# EAGLE board dw08a4lyr (EAGLE 6.6.0), part 1 of 3
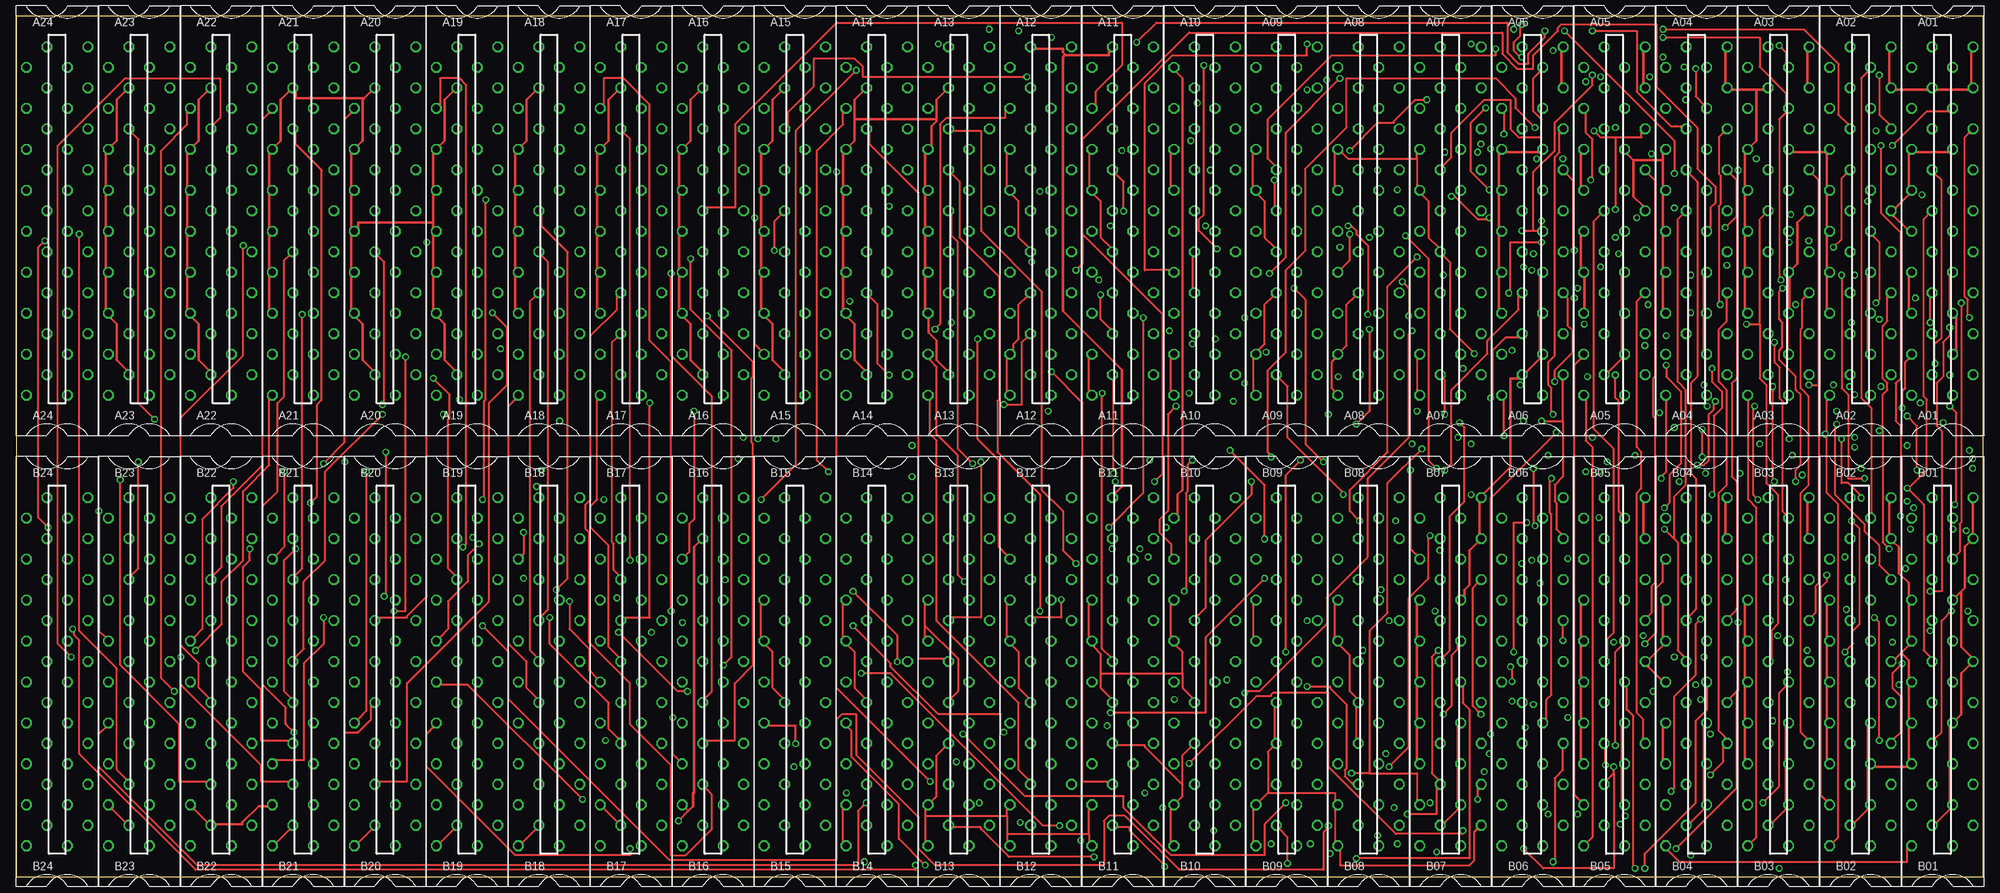
[diagram p6: board, top side]
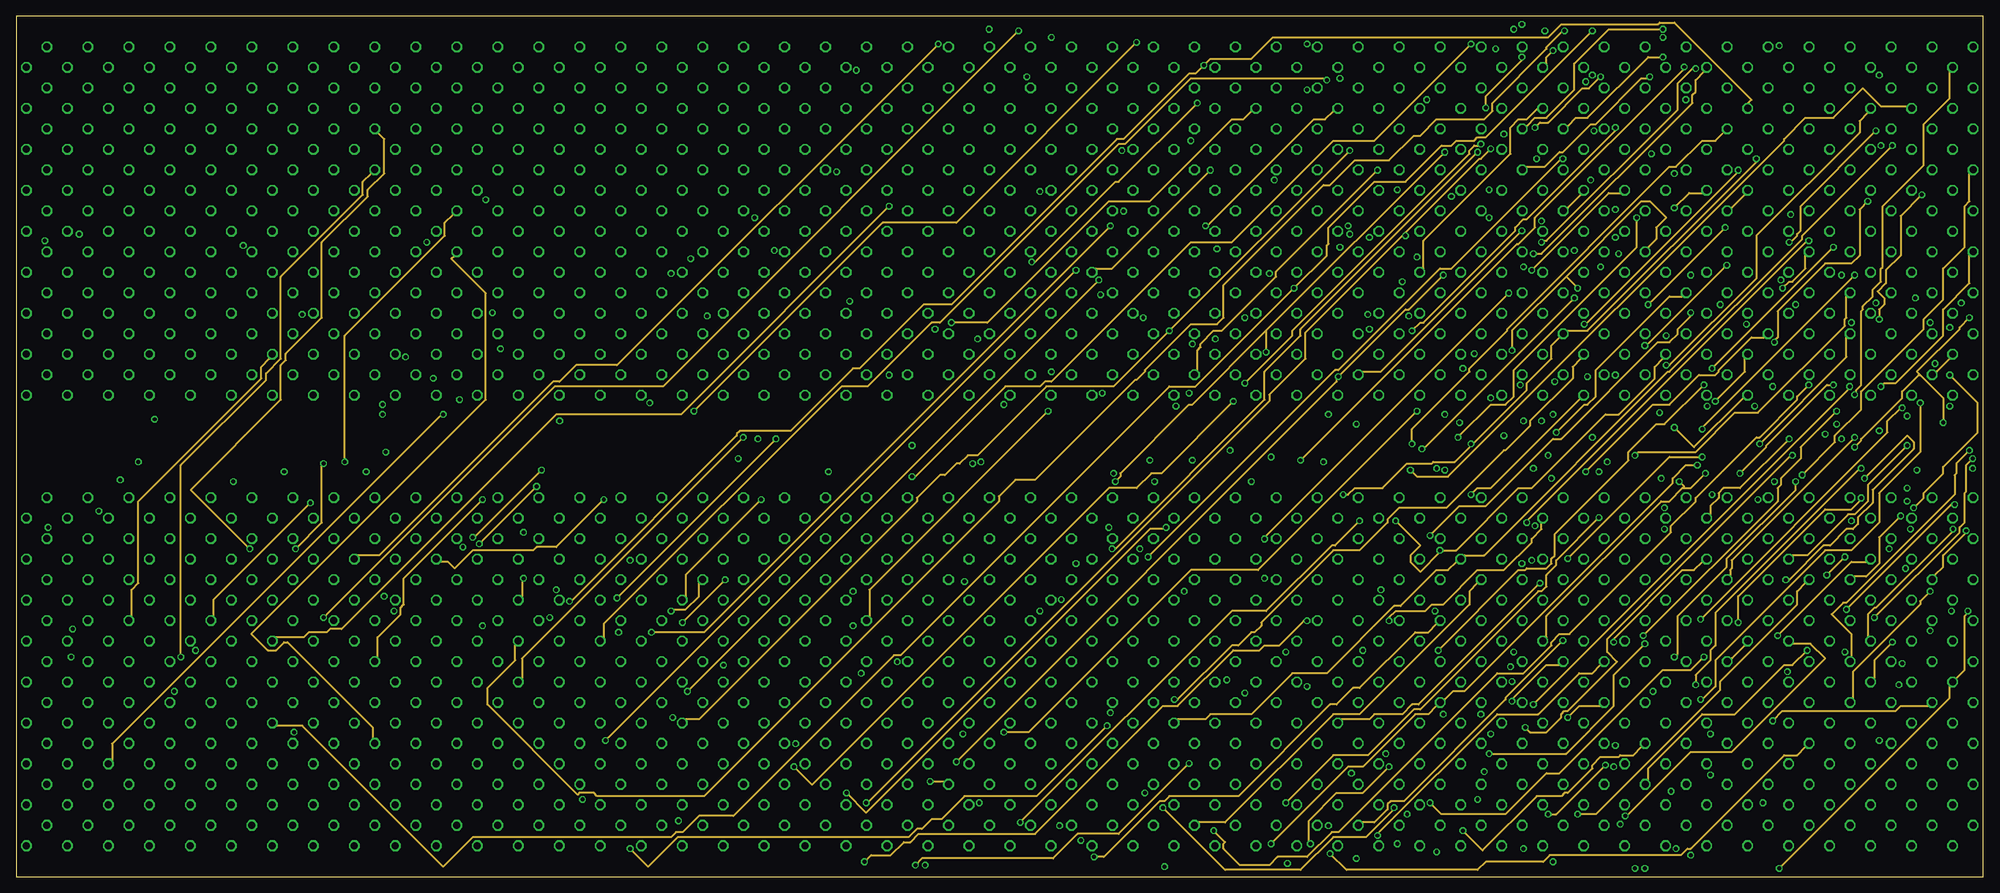
[diagram p7: board, inner layer 2]
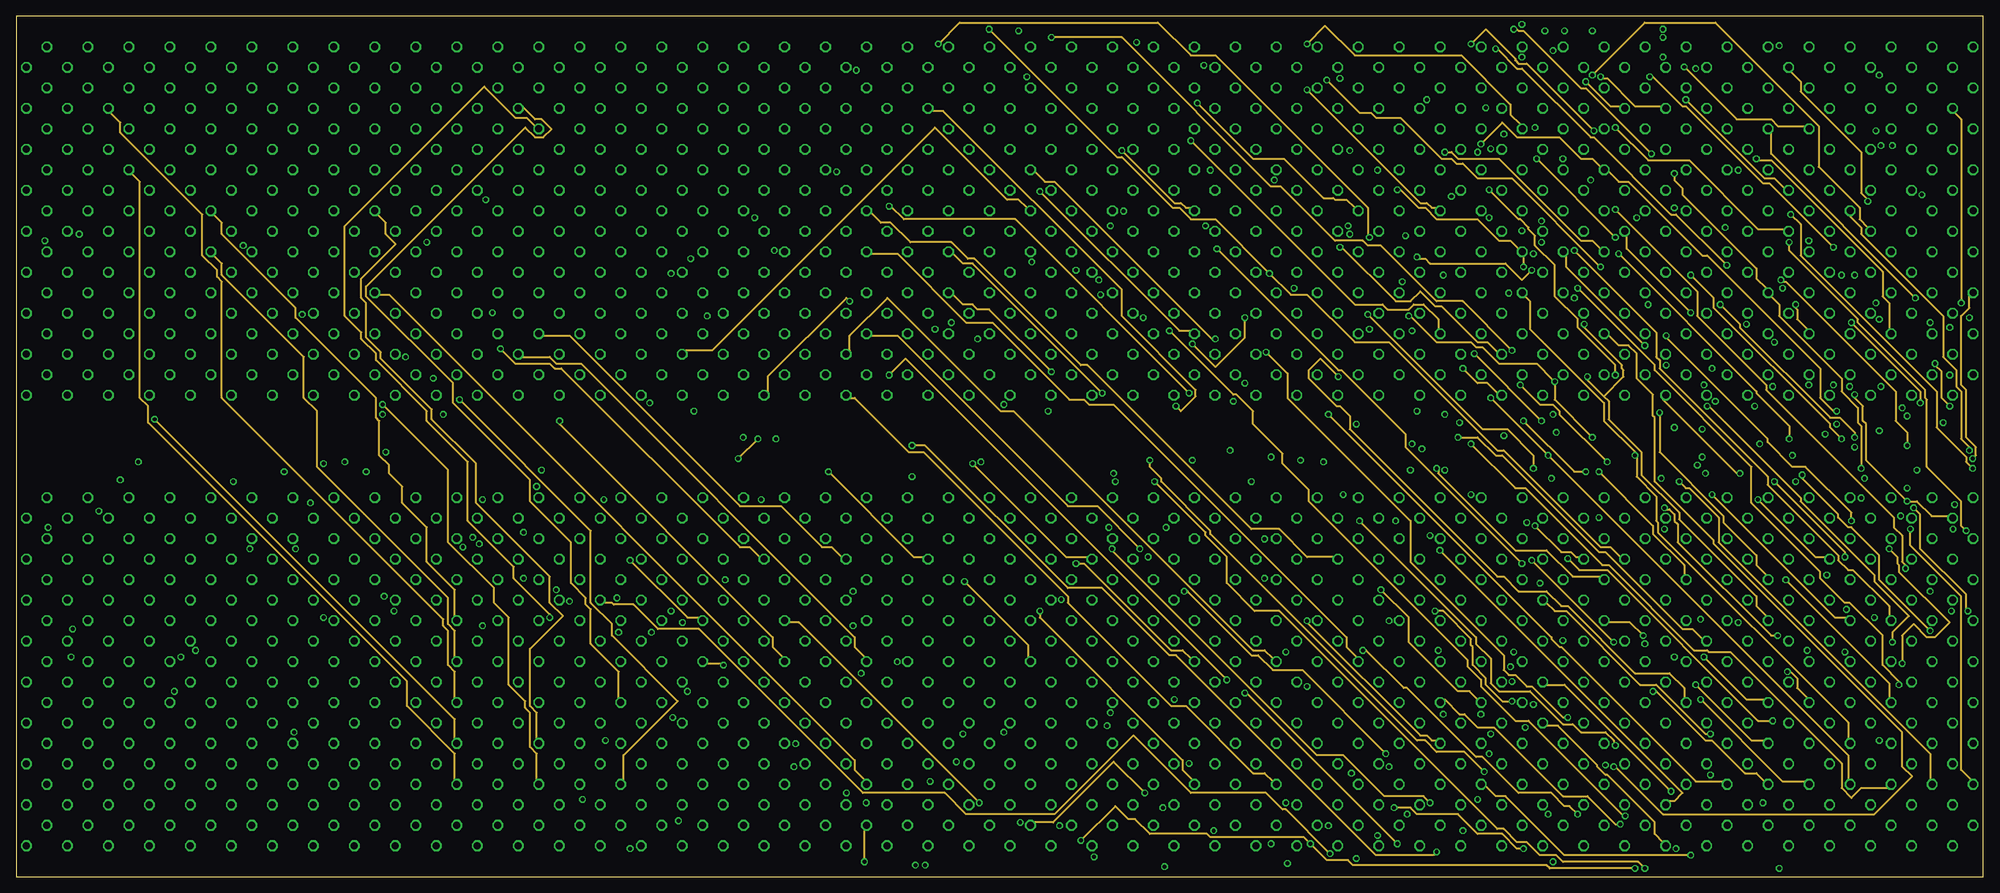
[diagram p8: board, inner layer 15]
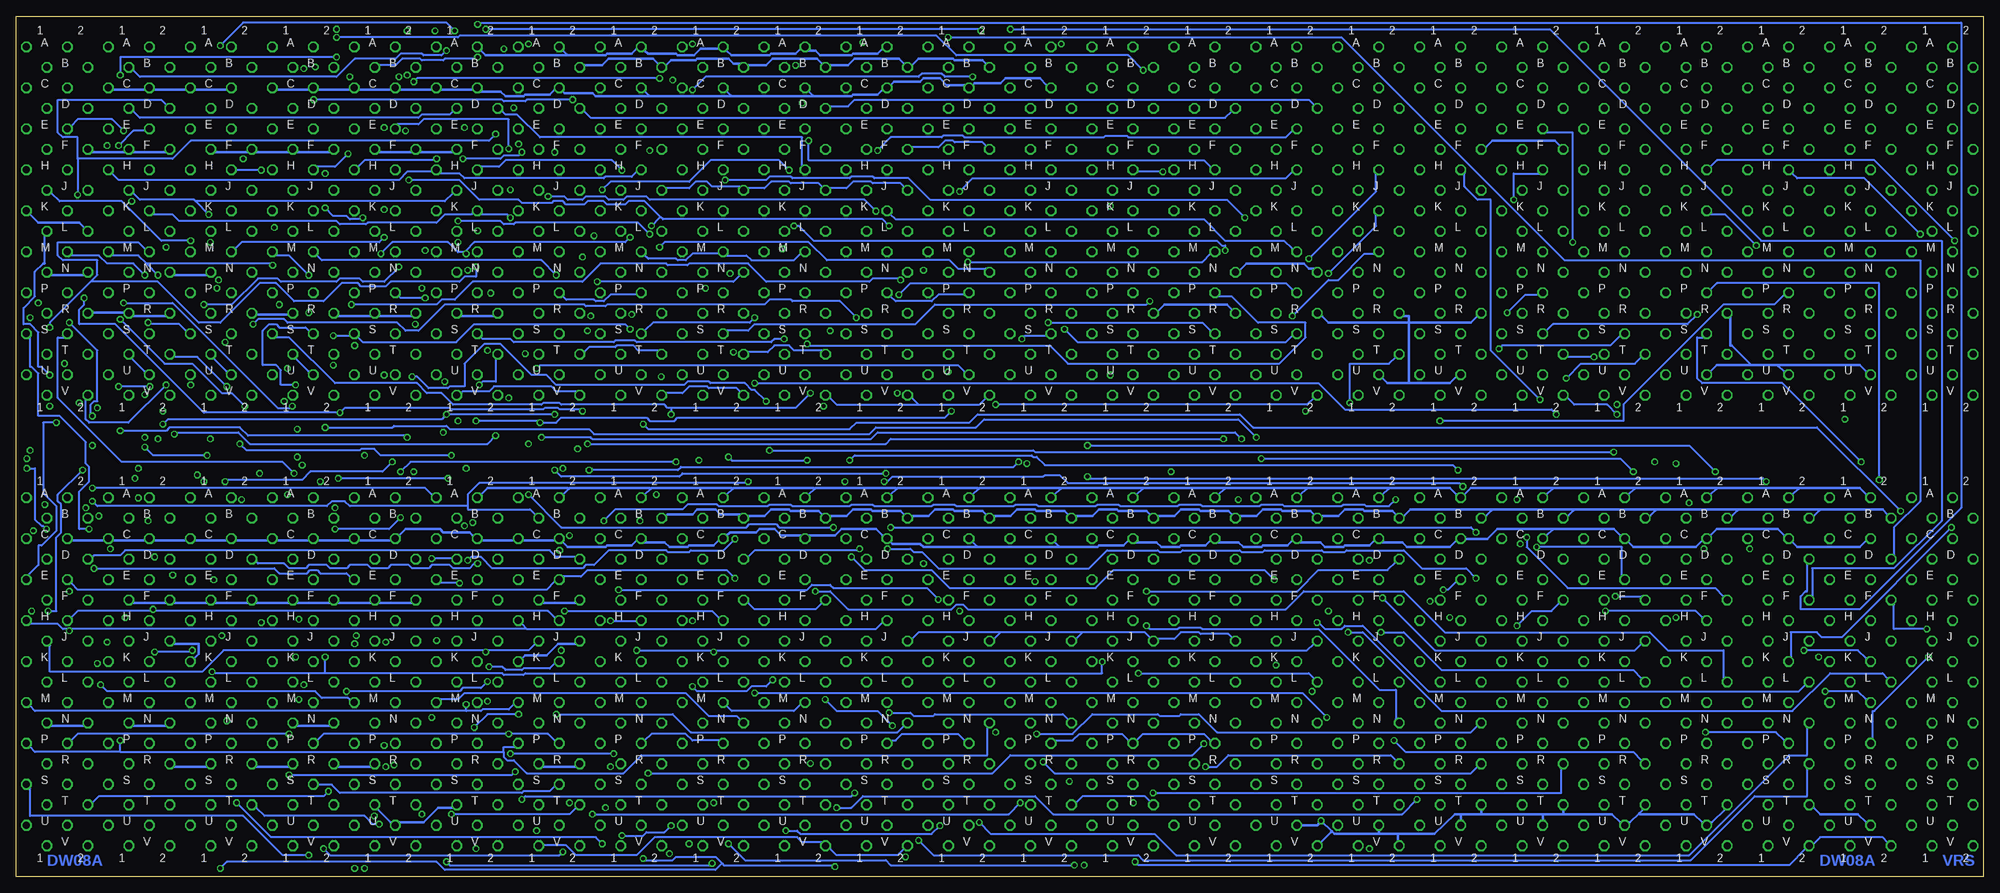
[diagram p9: board, bottom side, seen from below]

Size 304.8 x 133.35 mm. Coordinates in mm from the lower left corner, seen from the top.
Outline: 0,0 304.8,0 304.8,133.35 0,133.35 0,0
Copper layers (1*2*15*16): Top 0.035mm / dielectric 1.5mm / 2 0.035mm / dielectric 0.15mm / 15 0.035mm / dielectric 0.2mm / Bottom 0.035mm
Design rules "10mils": minimum track width 12mil, minimum drill 24mil, track to track 10mil, track to pad 10mil, pad to pad 10mil, via to via 10mil, smd to smd 10mil, copper to edge 25mil, drill to drill 10mil, minimum pad ring 10mil, minimum via ring 8mil, stop-mask expansion 0mil, vias tented up to drill 0mil, thermal gap 10mil
Net classes: 1 supply: width 0.381 mm

## Footprints (pad centres in the part's own frame; a part is rotated, then mirrored left to right if it is on the bottom)
H807 = drill 1.092 octagon: A1 4.763,28.575; A2 -1.587,28.575; B1 1.587,25.4; B2 -4.763,25.4; C1 4.763,22.225; C2 -1.587,22.225; D1 1.587,19.05; D2 -4.763,19.05; E1 4.763,15.875; E2 -1.587,15.875; F1 1.587,12.7; F2 -4.763,12.7; H1 4.763,9.525; H2 -1.587,9.525; J1 1.587,6.35; J2 -4.763,6.35; K1 4.763,3.175; K2 -1.587,3.175; L1 1.587,0; L2 -4.763,0; M1 4.763,-3.175; M2 -1.587,-3.175; N1 1.587,-6.35; N2 -4.763,-6.35; P1 4.763,-9.525; P2 -1.587,-9.525; R1 1.587,-12.7; R2 -4.763,-12.7; S1 4.763,-15.875; S2 -1.587,-15.875; T1 1.587,-19.05; T2 -4.763,-19.05; U1 4.763,-22.225; U2 -1.587,-22.225; V1 1.587,-25.4; V2 -4.763,-25.4

## Placement (x,y rotation side)
A01  M903  [H807]  298.45,100.01 0 top
A02  M903  [H807]  285.75,100.01 0 top
A03  M903  [H807]  273.05,100.01 0 top
A04  M903  [H807]  260.35,100.01 0 top
A05  M903  [H807]  247.65,100.01 0 top
A06  M907  [H807]  234.95,100.01 0 top
A07  M651  [H807]  222.25,100.01 0 top
A08  M651  [H807]  209.55,100.01 0 top
A09  M651  [H807]  196.85,100.01 0 top
A10  M651  [H807]  184.15,100.01 0 top
A11  M651  [H807]  171.45,100.01 0 top
A12  M651  [H807]  158.75,100.01 0 top
A13  W011  [H807]  146.05,100.01 0 top
A14  W011  [H807]  133.35,100.01 0 top
A15  W011  [H807]  120.65,100.01 0 top
A16  W011  [H807]  107.95,100.01 0 top
A17  W011  [H807]  95.25,100.01 0 top
A18  W011  [H807]  82.55,100.01 0 top
A19  W011  [H807]  69.85,100.01 0 top
A20  W011  [H807]  57.15,100.01 0 top
A21  W011  [H807]  44.45,100.01 0 top
A22  W011  [H807]  31.75,100.01 0 top
A23  W011  [H807]  19.05,100.01 0 top
A24  H807  [H807]  6.35,100.01 0 top
B01  M903  [H807]  298.45,30.16 0 top
B02  M903  [H807]  285.75,30.16 0 top
B03  M903  [H807]  273.05,30.16 0 top
B04  M903  [H807]  260.35,30.16 0 top
B05  M903  [H807]  247.65,30.16 0 top
B06  M101  [H807]  234.95,30.16 0 top
B07  M907  [H807]  222.25,30.16 0 top
B08  M651  [H807]  209.55,30.16 0 top
B09  M651  [H807]  196.85,30.16 0 top
B10  M651  [H807]  184.15,30.16 0 top
B11  M651  [H807]  171.45,30.16 0 top
B12  M651  [H807]  158.75,30.16 0 top
B13  M651  [H807]  146.05,30.16 0 top
B14  M651  [H807]  133.35,30.16 0 top
B15  M651  [H807]  120.65,30.16 0 top
B16  M517  [H807]  107.95,30.16 0 top
B17  M517  [H807]  95.25,30.16 0 top
B18  M517  [H807]  82.55,30.16 0 top
B19  M517  [H807]  69.85,30.16 0 top
B20  M517  [H807]  57.15,30.16 0 top
B21  M517  [H807]  44.45,30.16 0 top
B22  M517  [H807]  31.75,30.16 0 top
B23  M517  [H807]  19.05,30.16 0 top
B24  H807  [H807]  6.35,30.16 0 top

## Tracks (layer width: path | path; a pad name or v marks a point on that pad's centre or on a via)
!I_MB03  (via drill 0.61)
  Top 0.305: v241.43,97.03 241.17,97.28 241.17,107.95 240.16,108.97 A06.H1
  15 0.305: v241.43,97.03 254.13,84.33 254.13,80.52 254.63,80.01 254.63,78.74 271.4,61.98 271.4,60.71 282.32,49.78 282.32,49.02 283.85,47.5 284.61,47.5 290.19,41.91 290.19,40.39 B02.H1
  Bottom 0.305: A08.H2 208.66,109.22 209.42,108.46 213.49,108.46 213.74,108.2 235.33,108.2 236.09,108.97 239.14,108.97 A06.H1 240.41,109.22 244.22,109.22 245.49,107.95 288.93,107.95 289.94,108.97 A02.H1
!I_MB04  (via drill 0.61)
  Top 0.305: 235.08,100.08 235.84,100.08 A06.L1 | v233.3,100.08 235.08,100.08 | v288.16,88.9 288.67,89.41 288.67,98.3 287.65,99.31 A02.L1 | 235.08,100.08 235.08,109.22 238.38,112.52 238.38,116.84 244.22,122.68 v244.22,124.21
  2 0.305: v233.3,100.08 211.46,78.23 208.66,78.23 A08.U2 | v290.7,36.32 287.91,33.53 287.91,30.73 B02.L1
  15 0.305: v290.7,36.32 290.7,37.85 293.24,40.39 287.91,45.72 287.91,46.74 276.48,58.17 276.48,58.67 262.25,72.9 v262,72.9 | v244.22,124.21 252.35,132.33 263.27,132.33 279.27,116.33 279.27,109.98 285.62,103.63 285.62,101.85 286.89,100.58 A02.L1
  Bottom 0.305: v262,72.9 262.25,72.64 264.29,72.64 280.54,88.9 v288.16,88.9
!I_MB05  (via drill 0.61)
  Top 0.305: v292.23,33.02 290.7,31.5 290.7,29.21 291.97,27.94 291.97,22.35 290.96,21.34 B02.P1 | v290.19,50.8 289.18,51.82 289.18,69.09 | 289.18,69.09 289.18,74.68 289.94,75.44 289.94,76.45 289.18,77.22 289.18,85.34 289.94,86.11 289.94,89.92 A02.P1 | v238.38,76.71 238.38,78.49 241.17,81.28 241.17,84.58 240.41,85.34 240.41,89.66 240.16,89.92 A06.P1 | v288.67,69.09 289.18,69.09 | v214.76,92.2 215.77,91.19 v215.77,86.87
  15 0.305: v292.23,33.02 292.23,37.34 294,39.12 296.04,37.08 297.31,37.08 299.59,39.37 291.72,47.24 291.72,48.26 291.46,48.51 291.46,49.53 v290.19,50.8 | v244.22,68.07 238.38,73.91 v238.38,76.71 238.12,76.96 235.59,79.5 229.74,79.5 227.2,82.04 226.19,82.04 225.43,82.8 220.09,82.8 216.03,86.87 v215.77,86.87
  Bottom 0.305: v244.22,68.07 244.47,68.33 268.86,68.33 270.13,69.6 281.05,69.6 281.56,69.09 v288.67,69.09 | v214.76,92.2 193.68,92.2 192.66,93.22 A09.N2
!I_MB06  (via drill 0.61)
  Top 0.305: v269.88,58.42 269.11,59.18 269.11,72.64 v269.37,72.9 | v230.5,115.06 230.5,118.36 A06.D2
  2 0.305: v288.67,86.36 288.67,87.88 289.43,88.65 289.43,89.66 288.42,90.68 289.69,91.95 289.69,93.98 291.97,96.27 291.97,102.36 v295.27,105.66
  15 0.305: v269.88,58.42 278.76,49.53 280.29,49.53 B02.D2
  Bottom 0.305: A10.H2 183.01,110.24 183.01,114.55 223.65,114.55 227.2,118.11 228.98,118.11 229.49,118.62 A06.D2 | v269.37,72.9 271.4,74.93 272.92,74.93 277.5,79.5 281.81,79.5 v288.67,86.36 | 295.27,111.25 295.27,114.55 297.56,114.55 298.32,115.32 298.32,120.4 282.32,120.4 281.56,119.63 A02.D2 | 295.27,111.25 v295.27,105.66 | v230.5,115.06 231.52,114.05 277.75,114.05 280.54,111.25 295.27,111.25
!I_MB07  (via drill 0.61)
  Top 0.305: v262.76,59.18 263.02,59.44 263.02,71.37 264.29,72.64 264.29,75.18 262.76,76.71 v262.76,78.74 | v281.56,97.54 282.83,98.81 282.83,108.2 283.59,108.97 A02.H2
  2 0.305: v210.95,109.47 195.2,93.73 195.2,92.96 186.82,84.58 185.55,84.58 183.51,82.55 183.51,82.04 183.01,81.53 183.01,78.49 A10.U2 | v281.56,97.54 v262.76,78.74 | v253.11,123.95 252.86,123.7 251.84,123.7 244.73,116.59 243.97,116.59 239.65,112.27 239.14,112.27 236.85,109.98 234.06,109.98 A06.H2
  15 0.305: v262.76,59.18 281.81,40.13 283.59,40.13 B02.H2 | v253.11,123.95 253.62,123.95 258.19,119.38 258.7,119.38 270.64,107.44 271.65,107.44 281.31,97.79 v281.56,97.54
  Bottom 0.305: v210.95,109.47 212.47,111 228.98,111 230,109.98 232.79,109.98 A06.H2
!I_MB08  (via drill 0.61)
  Top 0.305: v296.55,44.2 298.32,44.2 298.32,69.09 297.56,69.85 297.56,76.45 298.58,77.47 298.58,82.8 299.59,83.82 v299.59,85.09
  2 0.305: v185.04,109.47 169.8,94.23 167.26,94.23 A11.N2 | v296.55,44.2 295.02,42.67 295.02,42.16 284.61,31.75 284.61,27.69 B02.M2
  15 0.305: v214,106.43 214.5,106.43 217.3,103.63 218.31,103.63 220.09,101.85 226.44,101.85 229.74,98.55 231.52,98.55 232.79,97.28 A06.M2 233.55,96.27 v233.55,94.49
  Bottom 0.305: v185.04,109.47 186.56,111 197.23,111 200.53,107.7 212.72,107.7 v214,106.43 | v299.59,85.09 299.59,85.85 293.24,92.2 | 293.24,92.2 292.23,93.22 292.23,95.5 297.56,95.5 298.32,96.27 298.32,98.3 285.88,98.3 284.86,97.28 A02.M2 | v233.55,94.49 233.55,92.96 235.33,92.96 236.09,92.2 246.76,92.2 247.52,91.44 251.33,91.44 251.84,91.95 254.38,91.95 257.18,89.15 261.75,89.15 264.54,91.95 267.08,91.95 273.18,85.85 276.48,85.85 282.83,92.2 293.24,92.2
!O_MB03  (via drill 0.61)
  Top 0.305: v117.47,97.03 117.47,101.6 118.49,102.62 A15.K2
  2 0.305: v184.28,100.84 184.53,100.84 201.04,117.35 202.82,117.35 204.09,118.62 A08.D2
  Bottom 0.305: v117.47,97.03 117.47,97.79 117.98,97.79 118.75,98.55 181.23,98.55 183.51,100.84 v184.28,100.84
!O_MB04  (via drill 0.61)
  15 0.305: v190.37,86.61 190.37,83.57 185.8,78.99 v182.25,82.55
  Bottom 0.305: v190.37,86.61 191.13,85.85 206.12,85.85 207.39,84.58 A08.S2 | v182.25,82.55 181.99,82.3 144.65,82.3 141.86,79.5 109.09,79.5 105.03,83.57 105.03,85.85 112.39,85.85 116.46,89.92 118.49,89.92 A15.P2
!O_MB05  (via drill 0.61)
  Top 0.305: v114.43,102.11 114.43,82.55 115.44,81.53 A15.T2 | v194.94,107.95 194.94,103.89 A09.K2
  Bottom 0.305: v114.43,102.11 117.22,104.9 163.19,104.9 166.5,108.2 171.83,108.2 172.09,108.46 175.39,108.46 175.64,108.2 184.53,108.2 184.78,108.46 188.09,108.46 188.59,107.95 v194.94,107.95
!O_MB06
  Bottom 0.305: A16.D2 103.76,119.63 104.52,120.4 174.88,120.4 175.9,119.38 178.69,119.38 A10.D2
!O_MB07  (via drill 0.61)
  15 0.305: v158.62,106.17 180.21,84.58 181.99,84.58 A10.S2
  Bottom 0.305: v158.62,106.17 156.59,108.2 108.08,108.2 107.06,109.22 A16.H2
!O_MB08
  Bottom 0.305: A16.M2 107.06,97.28 108.33,98.55 117.47,98.55 120.78,101.85 168.53,101.85 169.29,102.62 A11.K2
-15V
  Top 0.381: A10.B2 179.71,124.71 180.72,123.7 180.72,59.94 179.96,59.18 179.96,56.13 B10.B2
  Bottom 0.381: 25.4,56.77 26.29,55.88 B22.B2 | 25.4,56.77 25.27,56.9 15.62,56.9 14.86,56.13 B23.B2 | 38.1,56.77 37.97,56.9 25.53,56.9 25.4,56.77 | 38.1,56.77 38.99,55.88 B21.B2 | 50.8,56.77 50.67,56.9 38.23,56.9 38.1,56.77 | 50.8,56.77 51.69,55.88 B20.B2 | 63.5,56.77 63.37,56.9 50.93,56.9 50.8,56.77 | 63.5,56.77 64.39,55.88 B19.B2 | 76.2,56.77 76.07,56.9 63.63,56.9 63.5,56.77 | 76.2,56.77 77.09,55.88 B18.B2 | 76.2,56.77 76.33,56.9 88.77,56.9 89.79,55.88 B17.B2 91.06,56.13 91.57,56.64 95.89,56.64 96.14,56.9 98.93,56.9 99.95,55.88 102.49,55.88 B16.B2 103.76,56.13 104.27,56.64 108.58,56.64 108.84,56.9 111.63,56.9 112.65,55.88 115.19,55.88 B15.B2 116.46,56.13 116.97,56.64 121.28,56.64 121.54,56.9 124.33,56.9 125.35,55.88 127.89,55.88 B14.B2 129.16,56.13 129.67,56.64 133.99,56.64 134.24,56.9 137.03,56.9 138.05,55.88 140.59,55.88 B13.B2 141.86,56.13 142.37,56.64 146.69,56.64 146.94,56.9 149.73,56.9 150.75,55.88 153.29,55.88 B12.B2 154.56,56.13 155.07,56.64 159.38,56.64 159.64,56.9 162.43,56.9 163.45,55.88 165.99,55.88 B11.B2 167.26,56.13 167.77,56.64 172.09,56.64 172.34,56.9 175.13,56.9 176.15,55.88 178.69,55.88 B10.B2 179.96,56.13 180.47,56.64 184.78,56.64 185.04,56.9 187.83,56.9 188.85,55.88 191.39,55.88 B09.B2 192.66,56.13 195.71,56.13 196.47,56.9 199.26,56.9 200.03,56.13 203.84,56.13 204.09,55.88 B08.B2 | A07.B2 216.79,125.73 214,125.73 212.98,126.75 206.12,126.75 205.36,125.98 A08.B2 204.09,125.73 203.33,126.49 199.52,126.49 199.26,126.75 194.44,126.75 193.68,125.98 192.66,125.98 A09.B2 191.39,125.73 188.59,125.73 187.58,126.75 180.72,126.75 179.96,125.98 A10.B2 178.69,125.73 175.9,125.73 174.88,126.75 168.02,126.75 167.26,125.98 A11.B2 165.99,125.73 164.97,126.75 159.64,126.75 159.38,126.49 155.07,126.49 154.56,125.98 A12.B2
A06U1  (via drill 0.61)
  Top 0.305: A12.F2 153.54,112.01 153.54,106.93 A12.J2 154.31,105.66 155.32,104.65 155.32,99.06 156.84,97.54 A12.M2 | A11.F2 166.24,112.01 166.24,106.93 A11.J2 167,105.66 168.02,104.65 168.02,99.06 169.54,97.54 A11.M2 | A10.J2 178.94,106.93 178.94,112.01 A10.F2 | A10.P2 182.25,91.19 182.25,96.27 A10.M2 | A09.F2 191.64,112.01 191.64,106.93 A09.J2 192.41,105.66 193.42,104.65 193.42,99.06 194.94,97.54 A09.M2 | 239.65,70.61 239.65,77.22 A06.U1 | 239.65,70.61 239.65,61.98 238.38,60.71 238.38,58.17 238.63,57.91 238.63,53.85 239.4,53.09 B06.C1 | A08.J2 204.34,106.93 204.34,112.01 A08.F2 205.36,112.27 206.38,111.25 217.04,111.25 | 217.04,111.25 217.04,112.01 A07.F2 | 217.04,111.25 217.04,106.93 A07.J2 217.81,105.66 218.82,104.65 218.82,99.06 220.34,97.54 A07.M2 221.11,96.27 222.12,95.25 222.12,84.84 v225.93,81.03 | v236.35,70.61 239.65,70.61
  15 0.305: v225.93,81.03 v236.35,70.61
  Bottom 0.305: A12.F2 154.56,113.28 155.07,113.79 159.38,113.79 159.64,114.05 160.91,114.05 161.93,113.03 165.99,113.03 A11.F2 | A08.M2 207.39,96.27 206.88,95.76 202.56,95.76 202.31,95.5 201.04,95.5 200.03,96.52 195.96,96.52 A09.M2 194.69,96.27 191.64,96.27 190.88,95.5 184.28,95.5 183.26,96.52 A10.M2 | A11.J2 167.26,106.93 167.77,107.44 172.09,107.44 172.34,107.7 175.13,107.7 176.15,106.68 178.69,106.68 A10.J2 179.96,106.93 180.47,107.44 184.78,107.44 185.04,107.7 187.83,107.7 188.85,106.68 191.39,106.68 A09.J2 192.66,106.93 196.98,106.93 197.74,107.7 199.52,107.7 200.53,106.68 204.09,106.68 A08.J2
A06V1
  Top 0.305: A10.V2 178.94,75.18 178.94,80.26 A10.T2 | A11.V2 166.24,75.18 166.24,80.26 A11.T2 | A12.V2 153.54,75.18 153.54,80.26 A12.T2 154.56,81.53 154.56,82.55 155.32,83.31 155.32,88.65 156.59,89.92 A12.P2 | A07.V2 217.04,75.18 217.04,80.26 A07.T2 | A09.V2 191.64,75.18 191.64,80.26 A09.T2 192.66,81.53 192.66,81.79 193.42,82.55 193.42,88.65 194.69,89.92 A09.P2 | A08.V2 204.34,75.18 203.84,75.69 203.84,79.76 204.34,80.26 A08.T2 205.36,81.53 206.12,82.3 206.12,88.65 207.39,89.92 A08.P2
  Bottom 0.305: A11.P2 169.29,89.92 168.53,89.15 162.94,89.15 161.93,90.17 157.86,90.17 A12.P2 | 164.97,73.15 165.99,74.17 A11.V2 | 164.97,73.15 155.57,73.15 154.56,74.17 A12.V2 | 164.97,73.15 177.67,73.15 178.69,74.17 A10.V2 | A06.V1 235.84,74.93 235.59,75.18 231.52,75.18 230.76,75.95 221.87,75.95 221.11,75.18 218.06,75.18 A07.V2 | A07.P2 220.09,89.92 219.58,89.41 215.26,89.41 215.01,89.15 213.74,89.15 212.72,90.17 208.66,90.17 A08.P2 | A09.V2 192.66,75.18 193.17,75.69 197.49,75.69 197.74,75.95 200.53,75.95 201.55,74.93 204.09,74.93 A08.V2 | A07.T2 216.79,81.28 216.03,82.04 211.96,82.04 211.71,82.3 209.17,82.3 208.41,81.53 205.36,81.53 A08.T2 | A10.T2 179.96,81.53 184.28,81.53 185.04,82.3 187.32,82.3 188.34,81.28 191.39,81.28 A09.T2
B07U1
  Top 0.305: B08.F2 204.34,42.16 204.34,37.08 B08.J2 205.1,35.81 206.63,34.29 206.63,28.7 207.65,27.69 B08.M2 207.65,26.42 207.65,21.34 B08.P2 | B09.V2 191.64,5.33 191.64,10.41 B09.T2 192.66,11.68 193.93,12.95 | B09.M2 194.94,26.42 194.94,21.34 B09.P2 194.69,20.07 193.93,19.3 193.93,12.95 | B07.U1 226.44,7.37 225.93,6.86 225.93,2.54 225.17,1.78 205.1,1.78 205.1,4.06 B08.V2 204.34,5.33 204.34,10.41 B08.T2 204.34,11.68 204.34,12.95 193.93,12.95 | B11.F2 166.24,42.16 166.24,37.08 B11.J2 167,35.81 167,35.56 168.02,34.54 168.02,31.5 | 168.02,31.5 168.02,29.21 169.54,27.69 B11.M2 | B09.J2 191.64,37.08 191.64,42.16 B09.F2 | B10.F2 178.94,42.16 178.94,37.08 B10.J2 179.71,35.81 180.72,34.8 180.72,31.5 | 180.72,31.5 180.72,29.21 182.25,27.69 B10.M2 | 168.02,31.5 180.72,31.5 | B12.F2 153.54,42.16 153.54,37.08 B12.J2 154.31,35.81 155.32,34.8 155.32,29.21 156.84,27.69 B12.M2 | 140.84,38.86 140.84,42.16 B13.F2 | 140.84,38.86 140.84,37.08 B13.J2 | 140.84,38.86 145.92,33.78 145.92,28.7 144.91,27.69 B13.M2 | B15.F2 115.44,42.16 115.44,37.08 B15.J2 116.2,35.81 117.22,34.8 117.22,29.21 118.75,27.69 B15.M2 | B14.F2 128.14,42.16 128.14,37.08 B14.J2 128.91,35.81 129.92,34.8 129.92,29.21 131.44,27.69 B14.M2
  Bottom 0.305: B08.P2 207.39,21.08 206.38,22.1 201.04,22.1 200.03,21.08 195.96,21.08 B09.P2 | B09.F2 191.39,42.42 190.37,41.4 180.97,41.4 179.96,42.42 B10.F2 | B15.J2 116.46,37.08 116.97,37.59 121.28,37.59 121.54,37.85 124.33,37.85 125.35,36.83 127.89,36.83 B14.J2 129.16,37.08 129.92,37.85 139.57,37.85 | 139.57,37.85 140.59,36.83 B13.J2 | 152.27,37.85 153.29,36.83 B12.J2 | 139.57,37.85 152.27,37.85 | 152.27,37.85 164.97,37.85 165.99,36.83 B11.J2 | B09.M2 194.69,26.42 193.93,25.65 184.28,25.65 183.26,26.67 B10.M2
B07V1
  Top 0.305: 166.24,6.6 166.24,10.41 B11.T2 | 166.24,6.6 166.24,5.33 B11.V2 | 153.54,9.4 153.54,10.41 B12.T2 | 153.54,9.4 153.54,6.6 | 153.54,6.6 153.54,5.33 B12.V2 | B14.V2 128.14,5.33 128.14,10.41 B14.T2 | 140.84,9.4 140.84,10.41 B13.T2 141.86,11.68 142.62,12.45 142.62,18.8 143.89,20.07 B13.P2 | 140.84,9.4 140.84,5.33 B13.V2 | 140.84,9.4 153.54,9.4 | 153.54,6.6 166.24,6.6 | B10.V2 178.94,5.33 178.94,10.41 B10.T2 179.96,11.68 180.72,12.45 180.72,14.22 | 180.72,14.22 180.72,18.8 181.99,20.07 B10.P2 | 180.72,14.22 174.88,20.07 174.88,20.32 170.56,20.32 B11.P2
  Bottom 0.305: B15.P2 119.76,21.08 120.78,22.1 130.18,22.1 131.19,21.08 B14.P2 132.46,21.08 133.48,22.1 140.08,22.1 141.1,21.08 143.89,21.08 B13.P2 | B14.T2 129.16,11.68 129.92,12.45 139.57,12.45 140.59,11.43 B13.T2 | B12.P2 157.86,21.08 158.88,22.1 167.51,22.1 168.53,21.08 169.29,21.08 B11.P2 | B07.V1 223.14,4.83 219.58,4.83 218.06,3.3 208.66,3.3 205.87,6.1 183.77,6.1 183.01,5.33 179.96,5.33 B10.V2 178.69,4.32 177.67,3.3 168.28,3.3 167.26,4.32 B11.V2
GND  (via drill 0.61)
  Top 0.381: A05.F2 242.44,112.01 242.44,106.93 A05.J2 | A06.R2 229.74,87.88 229.74,92.96 A06.N2 229.74,94.23 229.74,99.31 A06.L2 229.74,100.58 229.74,105.66 A06.J2 229.74,106.93 229.74,112.01 A06.F2 230.76,112.27 235.84,112.27 A06.F1 | A06.N1 236.09,92.96 236.09,87.88 A06.R1 236.09,86.61 236.09,81.53 A06.T1 236.09,80.26 234.06,78.23 A06.U2 232.79,77.22 231.52,77.22 231.52,63.5 227.46,59.44 B07.A1 226.69,58.17 226.69,53.09 B07.C1 225.17,50.55 225.17,45.21 224.41,44.45 224.41,43.43 B07.F1 | 250.57,111 250.57,105.41 252.09,103.89 A05.K1 | 250.57,111 249.56,112.01 A05.F1 | A05.U2 246.76,78.23 248.79,80.26 A05.T1 248.79,81.53 248.79,86.61 A05.R1 248.79,87.88 248.79,92.96 A05.N1 | A05.R2 242.95,87.88 242.95,92.96 A05.N2 242.44,94.23 242.44,99.31 A05.L2 | A04.R2 255.14,87.88 255.14,92.96 A04.N2 255.14,94.23 255.14,99.31 A04.L2 255.14,100.58 255.14,105.66 A04.J2 255.14,106.93 255.14,111 | 255.14,111 255.14,112.01 A04.F2 | 255.14,111 250.57,111 | A03.T1 274.45,81.53 274.45,86.61 A03.R1 274.7,87.88 274.7,92.96 A03.N1 275.97,95 275.97,101.35 A03.K1 | A04.T1 261.49,81.53 261.49,86.61 A04.R1 261.49,87.88 261.49,92.96 A04.N1 | A03.R2 267.84,87.88 267.84,92.96 A03.N2 267.84,94.23 267.84,99.31 A03.L2 267.84,100.58 267.84,105.66 A03.J2 267.84,106.93 267.84,112.01 A03.F2 269.62,114.05 269.62,121.92 | A01.L2 292.99,100.33 290.96,102.36 290.96,102.62 A02.K1 291.21,103.63 293.24,105.66 A01.J2 293.24,106.93 293.24,112.01 A01.F2 294.26,112.27 299.34,112.27 A01.F1 | A01.N1 299.59,92.96 299.59,87.88 A01.R1 300.61,86.87 300.61,81.53 A01.T1 | A02.R2 280.54,87.88 280.54,92.96 A02.N2 280.54,94.23 280.54,99.31 A02.L2 280.54,100.58 280.54,105.66 A02.J2 280.54,106.93 280.54,112.01 A02.F2 280.29,112.27 275.21,112.27 A03.F1
  Top 0.381: A02.N1 286.89,92.96 286.89,87.88 A02.R1 286.89,86.61 286.89,81.53 A02.T1 | A01.N2 293.24,92.96 293.24,87.88 A01.R2 | A06.A1 239.4,128.02 239.4,122.94 A06.C1 | A05.A1 252.09,128.02 252.09,122.94 A05.C1 | A04.A1 264.8,128.02 264.8,122.94 A04.C1 265.81,121.92 269.62,121.92 | 269.62,121.92 270.89,121.92 A03.C2 | A03.A1 277.5,128.02 277.5,122.94 A03.C1 | A02.A1 290.19,128.02 290.19,122.94 A02.C1 291.21,121.92 296.29,121.92 A01.C2 297.56,121.92 302.64,121.92 A01.C1 302.89,122.94 302.89,128.02 A01.A1 | A15.U2 118.75,78.49 117.22,80.01 117.22,85.6 116.2,86.61 A15.R2 115.44,87.88 115.44,92.96 A15.N2 115.44,94.23 115.44,99.31 A15.L2 115.44,100.58 115.44,105.66 A15.J2 115.44,106.93 115.44,112.01 A15.F2 117.22,114.05 117.22,120.4 A15.C2 | A14.U2 131.44,78.49 129.92,80.01 129.92,85.6 128.91,86.61 A14.R2 128.14,87.88 128.14,92.96 A14.N2 128.14,94.23 128.14,99.31 A14.L2 128.14,100.58 128.14,105.66 A14.J2 128.14,106.93 128.14,112.01 A14.F2 129.92,114.05 129.92,117.35 | A14.C2 129.92,120.4 129.92,117.35 | A13.U2 144.15,78.49 142.62,80.01 142.62,83.06 141.35,84.33 141.35,86.61 A13.R2 140.84,87.88 140.84,92.96 A13.N2 140.84,94.23 140.84,99.31 A13.L2 140.84,100.58 140.84,105.66 A13.J2 140.84,106.93 140.84,112.01 A13.F2 141.86,113.28 141.86,116.33 142.62,117.09 142.62,117.35 | A13.C2 142.62,120.4 142.62,117.35 | 142.62,117.35 129.92,117.35 | A16.U2 106.05,78.49 104.52,80.01 104.52,85.6 103.5,86.61 A16.R2 102.74,87.88 102.74,92.96 A16.N2 102.74,94.23 102.74,99.31 A16.L2 102.74,100.58 102.74,105.66 A16.J2 102.74,106.93 102.74,112.01 A16.F2 104.52,114.05 104.52,120.4 A16.C2
  Top 0.381: A18.R2 77.34,87.88 77.34,92.96 A18.N2 77.34,94.23 77.34,99.31 A18.L2 77.34,100.58 77.34,105.66 A18.J2 77.34,106.93 77.34,112.01 A18.F2 79.12,114.05 79.12,120.4 A18.C2 | A17.R2 90.04,87.88 90.04,92.96 A17.N2 90.04,94.23 90.04,99.31 A17.L2 90.04,100.58 90.04,105.66 A17.J2 90.04,106.93 90.04,112.01 A17.F2 91.82,114.05 91.82,120.4 A17.C2 | A19.U2 67.94,78.49 66.42,80.01 66.42,85.6 65.41,86.61 A19.R2 64.64,87.88 64.64,92.96 A19.N2 64.64,94.23 64.64,99.31 A19.L2 64.64,100.58 64.64,101.35 | 64.64,101.35 64.64,105.66 A19.J2 64.64,106.93 64.64,112.01 A19.F2 66.42,114.05 66.42,120.4 A19.C2 | A20.U2 55.24,78.49 53.72,80.01 53.72,85.6 52.7,86.61 A20.R2 51.94,87.88 51.94,92.96 A20.N2 51.94,94.23 51.94,99.31 A20.L2 | A20.L2 51.94,100.58 51.94,105.66 A20.J2 51.94,106.93 51.94,112.01 A20.F2 53.72,114.05 53.72,120.4 53.85,120.52 | 53.85,120.52 A20.C2 | A23.U2 17.14,78.49 15.62,80.01 15.62,85.6 14.61,86.61 A23.R2 13.84,87.88 13.84,92.96 A23.N2 13.84,94.23 13.84,99.31 A23.L2 13.84,100.58 13.84,105.66 A23.J2 13.84,106.93 13.84,112.01 A23.F2 15.62,114.05 15.62,120.4 A23.C2 | A21.R2 39.24,87.88 39.24,92.96 A21.N2 39.24,94.23 39.24,99.31 A21.L2 39.24,100.58 39.24,105.66 A21.J2 39.24,106.93 39.24,112.01 A21.F2 41.02,114.05 41.02,120.4 A21.C2 43.31,121.67 43.31,120.65 53.72,120.65 53.85,120.52 | A22.U2 29.84,78.49 28.32,80.01 28.32,85.6 27.3,86.61 A22.R2 26.54,87.88 26.54,92.96 A22.N2 26.54,94.23 26.54,99.31 A22.L2 26.54,100.58 26.54,105.66 A22.J2 26.54,106.93 26.54,112.01 A22.F2 28.32,114.05 28.32,120.4 A22.C2 | 64.64,101.35 52.96,101.35 52.96,100.58 A20.L2
  Top 0.381: B07.F2 217.04,42.16 217.04,37.08 B07.J2 217.04,35.81 217.04,30.73 B07.L2 217.04,29.46 217.04,24.38 B07.N2 217.04,23.11 217.04,18.03 B07.R2 | B07.U2 221.36,8.38 223.39,10.41 B07.T1 223.39,11.68 223.39,16.76 B07.R1 223.39,18.03 223.39,23.11 B07.N1 | B05.T1 248.79,11.68 248.79,16.76 B05.R1 248.79,18.03 248.79,23.11 B05.N1 | B04.N2 255.14,23.11 255.14,18.03 B04.R2 | B05.R2 242.44,18.03 242.44,23.11 B05.N2 242.44,24.38 242.44,29.46 B05.L2 242.44,30.73 242.44,35.81 B05.J2 242.44,37.08 242.44,42.16 B05.F2 | B03.U2 272.16,8.38 274.19,10.41 B03.T1 274.19,11.68 274.19,16.76 B03.R1 274.19,18.03 274.19,23.11 B03.N1 | B02.R2 280.54,18.03 280.54,23.11 B02.N2 280.54,24.38 280.54,29.46 B02.L2 280.54,30.73 280.54,35.81 B02.J2 280.54,37.08 280.54,42.16 B02.F2 | B04.U2 259.46,8.38 261.49,10.41 B04.T1 261.49,11.68 261.49,16.76 B04.R1 261.49,18.03 261.49,23.11 B04.N1 | B03.R2 267.84,18.03 267.84,23.11 B03.N2 267.84,24.38 267.84,29.46 B03.L2 267.84,30.73 267.84,35.81 B03.J2 267.84,37.08 267.84,42.16 B03.F2 | B04.L2 254.89,30.48 252.86,32.51 252.86,32.77 B05.K1 253.11,33.78 255.14,35.81 B04.J2 255.14,37.08 255.14,42.16 B04.F2 | B05.A1 252.09,58.17 252.09,53.09 B05.C1 | B04.A1 264.8,58.17 264.8,53.09 B04.C1 | B03.A1 277.5,58.17 277.5,53.09 B03.C1 | B02.A1 290.19,58.17 290.19,53.09 B02.C1 290.96,51.82 291.72,51.05 291.72,46.99 293.24,45.47 293.24,43.43 B01.F2 293.24,42.16 293.24,37.08 B01.J2 293.24,35.81 292.1,34.67 | 301.24,44.07 301.88,44.7 301.88,51.05 B01.C1 303.15,53.09 303.15,58.17 B01.A1 | 301.24,44.07 B01.F1 | 301.24,44.07 301.37,43.94 301.37,35.56 302.89,34.04 B01.K1 301.37,31.5 301.37,25.15 B01.N1 299.59,23.11 299.59,18.03 B01.R1 299.59,16.76 299.59,11.68 B01.T1 299.59,10.41 297.56,8.38 B01.U2
  Top 0.381: 292.1,34.67 291.21,33.78 B02.K1 | B02.U2 284.86,8.38 286.89,10.41 B02.T1 286.89,11.68 286.89,16.76 B02.R1 | B02.N1 286.89,23.11 286.89,18.03 B02.R1 | B02.R1 287.91,17.02 292.99,17.02 B01.R2 293.24,18.03 293.24,23.11 B01.N2 293.24,24.38 293.24,29.46 B01.L2 293.24,30.73 293.24,33.53 292.1,34.67 | B23.U2 16.89,8.38 14.86,10.41 14.86,10.67 B23.T2 | B22.T2 27.56,10.67 27.56,10.41 29.59,8.38 B22.U2 30.23,8.13 35.05,8.13 35.05,8.38 37.59,10.92 39.62,10.92 B21.T2 | B16.C2 105.03,51.05 105.03,12.95 104.9,12.95 104.9,10.92 104.14,10.16 | 104.14,10.16 v102.62,8.64 | B17.U2 B17.T2 | B16.T2 104.14,10.16 | B21.V2 39.88,4.83 42.67,7.62 42.67,7.87 B21.U2 | B20.V2 52.58,4.83 55.37,7.62 55.37,7.87 B20.U2 | B19.V2 65.28,4.83 68.07,7.62 68.07,7.87 B19.U2 | B18.V2 77.98,4.83 80.77,7.62 80.77,7.87 B18.U2
  2 0.381: A06.K1 240.41,103.63 242.44,105.66 A05.J2 | A01.U2 297.56,78.23 299.59,80.26 A01.T1 | A04.K1 265.81,103.63 267.84,105.66 A03.J2 | B04.K1 265.81,33.78 267.84,35.81 B03.J2
  Bottom 0.381: A06.R2 230.76,86.87 235.84,86.87 A06.R1 | A06.F1 237.11,112.27 242.19,112.27 A05.F2 243.46,112.27 248.54,112.27 A05.F1 | A05.R2 243.46,86.87 248.54,86.87 A05.R1 249.81,86.87 254.89,86.87 A04.R2 | A04.F2 256.16,112.27 261.24,112.27 A04.F1 262.51,112.27 267.59,112.27 A03.F2 268.86,112.27 273.94,112.27 A03.F1 | A03.U2 272.16,78.23 274.19,80.26 A03.T1 | A04.U2 259.46,78.23 261.49,80.26 A04.T1 | A03.R2 267.59,87.12 262.51,87.12 A04.R1 | A01.K1 301.37,101.35 295.02,101.35 A01.L2 | A02.U2 284.86,78.23 286.89,80.26 A02.T1 | A02.R2 281.56,86.87 286.64,86.87 A02.R1 287.91,87.38 292.99,87.38 A01.R2 | A02.F2 281.56,112.27 286.64,112.27 A02.F1 287.91,112.27 292.99,112.27 A01.F2 | A01.N1 299.34,93.22 294.26,93.22 A01.N2 | A03.N1 275.21,93.22 280.29,93.22 A02.N2 | 181.36,121.03 A10.C2 | 181.36,121.03 181.23,120.9 175.39,120.9 175.13,121.16 171.32,121.16 170.56,121.92 A11.C2 169.29,122.68 168.78,123.19 164.72,123.19 164.21,123.7 161.67,123.7 160.66,122.68 157.86,122.68 A12.C2 156.59,122.68 156.34,122.94 152.27,122.94 151.51,123.7 146.18,123.7 145.16,122.68 A13.C2 | 194.06,121.03 193.93,120.9 181.48,120.9 181.36,121.03 | 194.06,121.03 A09.C2 | 206.76,121.03 206.63,120.9 194.18,120.9 194.06,121.03 | 206.76,121.03 A08.C2 | 206.76,121.03 206.88,120.9 215.01,120.9 215.52,121.41 219.84,121.41 A07.C2 221.36,121.92 222.12,121.16 225.93,121.16 226.19,120.9 228.98,120.9 229.74,121.67 232.79,121.67 A06.C2 234.06,121.92 239.14,121.92 A06.C1 240.41,121.92 245.49,121.92 A05.C2 246.76,121.92 251.84,121.92 A05.C1 253.11,121.92 258.19,121.92 A04.C2 259.46,121.92 264.54,121.92 A04.C1
  Bottom 0.381: A03.C2 272.16,121.92 277.24,121.92 A03.C1 278.51,121.92 283.59,121.92 A02.C2 284.86,121.92 289.94,121.92 A02.C1 | A15.R2 117.22,88.65 126.87,88.65 127.89,87.63 A14.R2 | 89.03,76.45 92.33,76.45 A17.U2 | 89.03,76.45 82.68,76.45 81.66,77.47 A18.U2 | 89.03,85.85 89.03,86.87 89.79,86.87 A17.R2 | 89.03,85.85 89.03,76.45 | 89.03,85.85 79.38,85.85 78.36,86.87 A18.R2 | 89.03,85.85 101.47,85.85 102.49,86.87 A16.R2 | 35.94,79.25 31.88,79.25 31.75,79.12 | 35.94,79.25 41.27,79.25 42.29,78.23 A21.U2 | 31.75,79.12 30.86,78.23 A22.U2 | 35.94,79.25 38.99,82.3 39.24,82.3 39.24,86.61 A21.R2 | A23.U2 18.16,78.23 19.18,79.25 31.62,79.25 31.75,79.12 | A19.F2 66.42,114.05 76.07,114.05 77.09,113.03 A18.F2 | A15.N2 115.19,93.98 114.17,95 105.28,95 104.52,94.23 103.76,94.23 A16.N2 | B07.K1 226.44,33.78 225.93,34.29 222.63,34.29 220.85,36.07 218.06,36.07 B07.J2 | B07.F1 223.14,42.42 218.06,42.42 B07.F2 | B07.R2 218.06,17.02 223.14,17.02 B07.R1 | B05.T1 248.79,10.41 246.76,8.38 B05.U2 245.49,8.38 241.68,8.38 239.4,10.67 237.11,10.67 B06.T1 | B04.R2 254.89,17.02 249.81,17.02 B05.R1 | B05.F2 243.46,42.42 248.54,42.42 B05.F1 249.81,42.42 254.89,42.42 B04.F2 256.16,42.42 261.24,42.42 B04.F1 262.51,42.42 267.59,42.42 B03.F2 268.86,42.42 273.94,42.42 B03.F1 275.21,42.42 280.29,42.42 B02.F2 281.56,42.42 286.64,42.42 B02.F1 | B02.R2 280.29,17.02 275.21,17.02 B03.R1 | B03.R2 267.59,17.02 262.51,17.02 B04.R1 | B03.K1 277.24,33.78 276.48,34.54 276.48,36.07 280.29,36.07 B02.J2 | B04.N2 256.16,23.37 261.24,23.37 B04.N1 | B01.C2 296.29,52.07 291.21,52.07 B02.C1 289.94,52.07 284.86,52.07 B02.C2 283.59,52.07 278.51,52.07 B03.C1 277.24,52.07 272.16,52.07 B03.C2 270.89,52.07 265.81,52.07 B04.C1 264.54,52.07 259.46,52.07 B04.C2 258.19,52.07 253.11,52.07 B05.C1 251.84,52.07 246.76,52.07 B05.C2 245.49,52.83 244.47,53.85 239.14,53.85 238.63,53.34 234.57,53.34 234.06,52.83 B06.C2 232.79,52.07 227.71,52.07 B07.C1 226.44,52.07 221.36,52.07 B07.C2 219.33,51.05 213.49,51.05 213.23,51.31 209.42,51.31 208.66,52.07 B08.C2 207.39,51.82 204.34,51.82 203.58,51.05 200.79,51.05 200.53,51.31 196.72,51.31 195.96,52.07 B09.C2 194.69,52.83 194.18,53.34 190.12,53.34 189.61,53.85 187.32,53.85 186.31,52.83 183.26,52.83 B10.C2 181.99,52.83 177.93,52.83 176.91,53.85 171.58,53.85 170.56,52.83 B11.C2 169.04,51.56 164.72,51.56 164.21,51.05 156.08,51.05 155.96,51.18
  Bottom 0.381: B01.N1 299.34,23.37 294.26,23.37 B01.N2 | B02.N2 281.56,23.37 286.64,23.37 B02.N1 | B23.U2 18.16,8.38 19.43,9.65 25.27,9.65 26.29,10.67 B22.T2 | B21.T2 40.01,10.41 42.04,8.38 42.29,8.38 B21.U2 43.56,8.38 44.83,9.65 53.21,9.65 53.34,9.78 | 53.34,9.78 54.74,8.38 54.99,8.38 B20.U2 56.26,8.38 57.53,9.65 65.09,9.65 | 53.34,9.78 52.7,10.41 B20.T2 | 80.96,9.65 81.92,9.65 85.09,6.6 90.68,6.6 | 80.96,9.65 77.79,9.65 | 77.79,9.65 68.26,9.65 | 68.26,9.65 65.09,9.65 | B23.C2 18.16,52.07 19.18,51.05 28.83,51.05 B22.C2 30.86,52.83 31.88,53.85 41.27,53.85 42.29,52.83 B21.C2 43.56,52.07 44.58,51.05 54.23,51.05 B20.C2 56.26,52.83 57.28,53.85 66.67,53.85 66.8,53.72 | 66.8,53.72 67.69,52.83 B19.C2 | 66.8,53.72 66.93,53.85 75.31,53.85 76.83,52.32 80.39,52.32 B18.C2 81.66,52.07 82.68,51.05 89.28,51.05 90.04,51.82 93.09,51.82 B17.C2 94.36,52.07 95.12,51.31 98.93,51.31 99.19,51.05 101.98,51.05 102.74,51.82 105.79,51.82 B16.C2 107.06,52.07 107.82,51.31 111.63,51.31 111.89,51.05 114.68,51.05 115.44,51.82 118.49,51.82 B15.C2 119.76,52.07 120.52,51.31 124.33,51.31 124.59,51.05 127.38,51.05 128.14,51.82 131.19,51.82 B14.C2 132.46,52.07 133.22,51.31 137.03,51.31 137.29,51.05 143.13,51.05 143.26,51.18 | 143.26,51.18 B13.C2 | 155.96,51.18 155.83,51.05 143.38,51.05 143.26,51.18 | 155.96,51.18 B12.C2 | 93.66,6.6 100.58,6.6 100.97,6.99 | 93.66,6.6 90.68,6.6 | 100.97,6.99 v102.62,8.64 103.19,7.94 B16.U2 | B18.T2 77.79,9.65 | B18.U2 80.96,9.65 | B17.U2 93.66,6.6 | B19.T2 65.09,9.65 | B19.U2 68.26,9.65 | 90.68,6.6 90.68,4.83 B17.V2 | B16.V2 103.12,4.83 101.09,6.86 100.97,6.99
I_3CYCLE  (via drill 0.61)
  Top 0.305: v72.26,38.86 76.33,34.8 76.33,27.43 101.22,2.54 127.13,2.54 127.13,24.38 127.89,25.15 130.18,25.15 130.18,18.8 139.83,9.14 139.83,4.32 142.37,1.78 168.53,1.78 168.53,8.64 169.29,9.4 171.83,9.4 180.21,1.02 202.56,1.02 202.56,6.86 203.33,7.62 v203.33,7.87 | A05.K2 245.49,102.62 244.47,101.6 244.47,69.34 247.52,66.29 247.52,37.85 246.51,36.83 246.51,34.04 B05.K2
  2 0.305: v210.95,6.35 210.95,6.6 229.49,25.15 235.84,25.15 242.19,31.5 244.22,31.5 245.49,32.77 B05.K2
  Bottom 0.305: v72.26,38.86 69.98,41.15 66.93,41.15 65.66,42.42 B19.F2 | v203.33,7.87 204.34,6.86 207.14,6.86 207.65,6.35 v210.95,6.35
I_AC00  (via drill 0.61)
  Top 0.305: v105.03,72.14 105.03,55.37 104.27,54.61 104.27,50.29 103.76,49.78 B16.D2 | v173.61,129.29 176.66,132.33 231.01,132.33 231.01,127.76 232.79,125.98 234.31,125.98 234.31,127.51 236.85,130.05 v236.85,131.06 | v273.18,128.78 274.19,127.76 274.19,125.98 A03.B1 | v272.42,82.8 272.42,79.76 273.18,78.99 273.18,74.17 273.69,73.66 273.69,56.64 274.19,56.13 B03.B1
  2 0.305: v105.03,72.14 134.24,101.35 145.67,101.35 v173.61,129.29 | v272.42,82.8 272.42,83.06 272.92,83.57 272.92,87.63 280.29,95 284.35,95 285.62,96.27 285.62,103.38 v286.89,104.65
  15 0.305: v286.89,104.65 286.89,104.9 285.88,105.92 285.88,112.27 276.48,121.67 276.48,123.19 274.95,124.71 A03.B1
  Bottom 0.305: v236.85,131.06 238.12,132.33 269.62,132.33 v273.18,128.78
I_AC01  (via drill 0.61)
  Top 0.305: v115.44,58.42 120.78,63.75 120.78,115.57 v130.18,124.97 | v255.14,130.05 270.13,130.05 270.13,125.48 274.19,121.41 274.19,119.63 A03.D1 274.19,118.36 273.18,117.35 273.18,92.71 v273.43,92.46
  2 0.305: v115.44,58.42 103.76,46.74 103.76,43.43 B16.F2 | v292.99,66.8 286.89,60.71 286.89,58.17 284.86,56.13 283.85,56.13 277.5,49.78 275.21,49.78 B03.D1
  15 0.305: v292.99,66.8 292.99,68.83 291.21,70.61 291.21,75.18 274.19,92.2 273.69,92.2 v273.43,92.46
  Bottom 0.305: v130.18,124.97 132.46,127.25 159.13,127.25 162.18,130.3 236.09,130.3 236.35,130.05 v255.14,130.05
I_AC02  (via drill 0.61)
  Top 0.305: v199.01,64.52 196.72,62.23 v196.72,34.8
  2 0.305: v241.94,9.65 244.73,9.65 264.03,28.96 264.03,30.23 275.97,42.16 275.97,44.2 277.24,45.47 B03.E1 | v258.44,125.48 258.44,125.22 235.33,102.11 235.33,100.58 232.79,98.04 232.54,98.04 v199.01,64.52
  15 0.305: v208.66,35.05 209.17,35.05 215.01,29.21 215.52,29.21 226.19,18.54 227.2,18.54 232.79,12.95 237.87,12.95 239.9,10.92 240.66,10.92 v241.94,9.65 | v258.44,125.48 266.57,117.35 271.91,117.35 272.92,116.33 277.24,116.33 A03.E1
  Bottom 0.305: v208.66,35.05 196.72,35.05 | 196.72,35.05 104.78,35.05 103.76,36.07 B16.J2 | 196.72,35.05 v196.72,34.8
I_AC03  (via drill 0.61)
  Top 0.305: v130.94,31.5 135.51,31.5 159.13,7.87 v161.67,7.87 | v277.75,76.2 279.27,76.2 | 279.27,76.2 279.27,107.95 278.26,108.97 A03.H1 | 279.27,76.2 279.27,45.47 278.76,44.96 278.76,40.89 278.26,40.39 B03.H1
  2 0.305: v185.55,7.11 187.32,5.33 187.07,5.08 187.07,4.32 189.61,1.78 194.18,1.78 195.45,3.05 200.03,3.05 203.84,6.86 204.85,6.86 229.49,31.5 233.55,31.5 237.87,35.81 237.87,36.32 239.14,37.59 240.66,37.59 256.41,53.34 256.41,54.36 260.22,58.17 260.22,58.67 269.62,68.07 270.13,68.07 275.97,73.91 275.97,74.42 v277.75,76.2
  Bottom 0.305: v130.94,31.5 104.52,31.5 103.76,30.73 B16.L2 | v161.67,7.87 162.94,6.6 183.26,6.6 183.77,7.11 v185.55,7.11
I_AC04  (via drill 0.61)
  Top 0.305: v206.63,112.52 210.95,116.84 213.49,116.84 213.49,117.09 216.79,120.4 v218.57,120.4
  2 0.305: v206.63,112.52 v178.69,84.58 170.05,75.95 159.64,75.95 148.97,65.28 147.45,65.28 146.18,64.01 145.67,64.01 143.89,62.23 143.13,62.23 139.57,58.67 139.57,58.17 105.79,24.38 103.76,24.38 B16.N2 | v249.3,9.4 249.56,9.4 259.46,19.3 265.81,19.3 280.29,33.78 278,36.07 275.21,36.07 B03.J1
  15 0.305: v258.7,120.4 270.89,108.2 272.42,108.2 273.94,106.68 A03.J1 | v249.3,9.4 249.05,9.4 234.31,24.13 232.28,24.13 226.95,29.46 226.95,30.48 224.92,32.51 224.92,33.53 200.28,58.17 200.28,59.94 196.22,64.01 196.22,65.53 191.64,70.1 191.64,72.14 189.1,74.68 188.59,74.68 v178.69,84.58
  Bottom 0.305: v218.57,120.4 225.68,120.4 225.93,120.14 229.24,120.14 229.49,120.4 v258.7,120.4
I_AC05  (via drill 0.61)
  Top 0.305: v101.73,24.64 101.73,19.05 102.74,18.03 B16.R2 | v270.64,11.43 273.18,13.97 273.18,28.45 274.19,29.46 B03.L1 | v216.28,84.58 215.77,84.07 215.77,68.07 209.42,61.72 209.42,49.53 203.07,43.18 203.07,39.12 192.66,28.7 190.63,28.7 v190.37,28.45
  2 0.305: v247.78,116.08 247.78,115.57 234.06,101.85 233.55,101.85 232.28,100.58 232.28,100.08 218.06,85.85 217.55,85.85 v216.28,84.58
  15 0.305: v190.37,28.45 190.63,28.45 v214,5.08 | v247.78,116.08 252.86,111 259.21,111 269.88,100.33 273.94,100.33 A03.L1
  Bottom 0.305: v101.73,24.64 105.54,28.45 v190.37,28.45 | v214,5.08 215.01,6.1 265.3,6.1 v270.64,11.43
I_AC06  (via drill 0.61)
  Top 0.305: v129.67,44.2 136.53,37.34 v136.53,33.27 | v273.69,91.19 273.18,90.68 273.18,86.36 273.69,85.85 273.69,82.04 273.18,81.53 273.18,80.01 275.72,77.47 275.72,75.44 276.48,74.68 276.48,63.75 275.72,62.99 v275.72,61.21
  2 0.305: v273.69,91.19 274.7,92.2 275.21,92.2 277.24,94.23 277.24,96.27 A03.M1 | v275.72,61.21 275.72,59.94 265.05,49.28 265.05,48.01 257.43,40.39 257.43,34.54 v256.92,34.04
  15 0.305: v274.45,31.75 274.95,31.75 275.97,30.73 275.97,29.21 277.5,27.69 B03.M1
  Bottom 0.305: v129.67,44.2 106.3,44.2 103,47.5 92.33,47.5 91.06,48.77 B17.D2 | v136.53,33.27 136.53,31.5 225.93,31.5 226.19,31.24 229.24,31.24 229.49,31.5 256.92,31.5 | 256.92,31.5 274.19,31.5 v274.45,31.75 | 256.92,31.5 v256.92,34.04
I_AC07  (via drill 0.61)
  Top 0.305: A03.P1 277.24,89.92 276.73,89.41 276.73,85.09 276.48,84.84 276.48,75.69 277.75,74.42 277.75,60.71 276.48,59.44 276.48,22.35 277.5,21.34 B03.P1
  2 0.305: v203.58,3.56 206.12,1.02 226.44,1.02 227.71,2.29 236.6,2.29 237.62,3.3 257.94,3.3 258.95,4.32 259.46,4.32 273.94,18.8 275.97,18.8 277.24,20.07 B03.P1
  15 0.305: v203.58,3.56 196.72,10.41 196.22,10.41 193.68,12.95 181.99,12.95 173.1,21.84 160.91,9.65 147.19,9.65 143.89,12.95 131.19,12.95 105.79,38.35 99.44,38.35 95.63,42.16 92.58,42.16 92.33,42.42 91.06,42.42 B17.F2
I_AC08  (via drill 0.61)
  2 0.305: v203.07,123.44 202.82,123.7 181.99,123.7 171.83,113.54 170.81,113.54 143.13,85.85 141.86,85.85 131.95,75.95 127.89,75.95 91.06,39.12 91.06,37.08 B17.J2 | v260.99,27.43 261.24,27.43 263.27,29.46 263.27,33.53 280.29,50.55 284.35,50.55 288.67,54.86 288.67,59.44 295.02,65.79 v295.02,73.41
  15 0.305: v203.07,123.44 208.15,118.36 209.93,118.36 210.69,117.6 214.5,117.6 220.85,111.25 222.38,111.25 223.14,110.49 224.16,110.49 226.44,108.2 231.78,108.2 v245.49,94.49 | v275.72,88.65 275.72,88.14 275.97,87.88 275.97,86.36 277.5,84.84 A03.S1 | v260.99,27.43 273.69,14.73 277.24,14.73 B03.S1 | v295.02,73.41 295.02,75.18 v284.35,85.85
  Bottom 0.305: v245.49,94.49 247.78,92.2 251.08,92.2 251.59,92.71 254.63,92.71 255.14,92.2 263.78,92.2 264.29,92.71 267.33,92.71 271.4,88.65 v275.72,88.65 | v284.35,85.85 284.1,85.6 279.53,85.6 278.51,84.58 A03.S1
I_AC09  (via drill 0.61)
  Top 0.305: v85.72,42.67 85.72,38.35 88.77,35.31 88.77,32 90.04,30.73 B17.L2 | v186.06,97.28 183.26,100.08 183.26,101.85 184.02,102.62 v184.02,125.73
  2 0.305: v85.72,42.67 85.98,42.67 111.63,68.33 111.63,68.58 112.14,69.09 120.02,69.09 129.67,78.74 130.68,78.74 140.59,88.65 144.91,88.65 170.56,114.3 171.58,114.3 181.74,124.46 182.75,124.46 v184.02,125.73 185.04,126.75 191.39,126.75 194.69,130.05 237.36,130.05 239.4,132.08 254.38,132.08 254.63,132.33 256.92,132.33 268.86,120.4 268.1,119.63 A03.D2
  15 0.305: v233.3,48.51 215.26,66.55 215.26,68.58 205.36,78.49 204.85,78.49 v186.06,97.28
  Bottom 0.305: v233.3,48.51 233.81,48.51 234.57,47.75 237.11,47.75 237.62,48.26 240.41,48.26 240.92,47.75 243.46,47.75 243.97,48.26 246.76,48.26 247.27,47.75 249.81,47.75 250.32,48.26 253.11,48.26 253.62,47.75 256.16,47.75 256.67,48.26 259.46,48.26 259.97,47.75 262.51,47.75 263.27,48.51 267.33,48.51 267.59,48.77 B03.D2
I_AC10  (via drill 0.61)
  Top 0.305: v129.67,38.86 135.51,33.02 135.51,32.51 142.88,25.15 152.53,25.15 152.53,22.86 v153.03,22.35
  2 0.305: v153.03,22.35 156.84,22.35 181.99,47.5 192.41,47.5 v217.04,72.14
  15 0.305: v254.63,71.88 254.63,65.79 264.54,55.88 264.54,54.86 269.62,49.78 269.62,48.26 271.14,46.74 B03.E2 | v294.26,89.66 271.91,112.01 271.91,115.32 A03.E2
  Bottom 0.305: v129.67,38.86 129.16,38.35 124.84,38.35 124.59,38.61 121.28,38.61 121.03,38.35 103,38.35 93.6,28.96 91.06,28.96 91.06,24.38 B17.N2 | v217.04,72.14 217.3,72.39 220.6,72.39 220.85,72.64 222.88,72.64 223.14,72.39 237.36,72.39 237.62,72.64 253.87,72.64 v254.63,71.88 254.89,71.88 275.72,71.88 289.43,85.6 295.02,85.6 295.02,87.88 294.26,88.65 v294.26,89.66
I_AC11  (via drill 0.61)
  2 0.305: v120.52,17.02 123.32,14.22 169.29,60.2 173.61,60.2 175.9,62.48 177.42,62.48 v188.59,73.66 | v266.83,109.47 266.83,109.22 243.21,85.6 v242.95,85.6
  15 0.305: v243.46,77.47 243.46,76.96 246,74.42 | 246,74.42 246.76,73.66 246.76,70.87 251.84,65.79 251.84,62.23 257.68,56.39 257.68,55.37 269.62,43.43 269.62,41.91 271.14,40.39 B03.H2 | v242.95,85.6 242.95,85.09 248.79,79.25 248.79,78.74 249.05,78.49 249.05,77.47 246,74.42
  Bottom 0.305: v120.52,17.02 118.75,17.02 116.97,18.8 91.82,18.8 91.06,18.03 B17.R2 | v188.59,73.66 190.37,75.44 190.88,75.44 191.9,76.45 197.23,76.45 197.49,76.71 200.79,76.71 201.29,76.2 221.11,76.2 222.63,77.72 224.92,77.72 229.74,82.55 232.28,82.55 235.33,79.5 235.33,75.95 237.62,75.95 237.87,75.69 240.92,75.69 242.7,77.47 v243.46,77.47 | v266.83,109.47 270.89,109.47 A03.H2
I_ACCEPT  (via drill 0.61)
  Top 0.305: v215.52,9.65 220.09,9.65 220.09,13.72 B07.S2 220.34,14.99 219.33,16 219.33,34.04 v220.34,35.05
  2 0.305: v261.49,76.2 255.4,70.1 254.13,70.1 249.81,65.79 249.81,64.52 238.38,53.09 238.38,49.78 237.87,49.28 237.87,48.51 237.11,47.75 234.06,47.75 233.81,47.5 232.79,47.5 v220.34,35.05
  15 0.305: v149.22,11.43 121.28,39.37 119.76,39.37 B15.H2
  Bottom 0.305: B07.S2 221.36,13.97 222.12,13.21 226.19,13.21 226.44,12.95 254.63,12.95 255.91,14.22 258.19,14.22 B04.S2 | v149.22,11.43 151,9.65 v215.52,9.65 | v261.49,76.2 263.78,76.2 263.78,78.49 264.54,79.25 266.57,79.25 266.57,84.58 265.56,85.6 264.54,85.6 264.03,85.09 259.97,85.09 259.46,84.58 A04.S2
I_ACCLR  (via drill 0.61)
  Top 0.305: v239.9,131.06 256.92,114.05 v256.92,108.97
  2 0.305: v239.9,131.06 239.65,131.06 237.11,128.52 237.11,128.27 228.73,119.89 228.73,118.62 227.46,117.35 220.09,117.35 217.55,114.81 216.53,114.81 212.72,111 207.39,111 203.58,107.19 202.56,107.19 187.07,91.69 187.07,86.61 186.06,85.6 181.99,85.6 174.88,78.49 174.88,78.23 173.61,76.96 173.35,76.96 157.86,61.47 154.81,61.47 152.27,58.93 152.27,58.17 106.55,12.45 90.04,12.45 89.53,12.95 87.25,12.95 87,12.7 73.03,26.67 73.03,29.21 77.34,33.53 77.34,35.81 B18.J2 | v260.22,29.72 260.22,31.24 262.51,33.53 262.51,35.05 263.27,35.81 263.27,40.89 285.62,63.25 v285.88,63.25
  15 0.305: v256.92,108.97 256.92,107.95 258.19,106.68 258.19,105.66 269.62,94.23 269.62,92.71 271.14,91.19 A03.P2 271.91,89.92 273.18,88.65 273.18,86.87 282.83,77.22 282.83,75.18 285.37,72.64 285.37,70.36 285.88,69.85 v285.88,63.25 | v260.22,29.72 268.86,21.08 270.89,21.08 B03.P2
I_ADD00  (via drill 0.61)
  2 0.305: v142.88,129.03 93.09,79.25 86.74,79.25 84.2,76.71 83.19,76.71 56.26,49.78 52.96,49.78 B20.D2 | v235.08,96.52 236.35,96.52 259.71,119.89 259.71,121.16 260.22,121.67 260.22,123.44 261.49,124.71 A04.B1 | v274.7,67.82 267.08,60.2 264.54,60.2 263.78,59.44 263.78,58.67 262.51,57.4 262.51,56.13 B04.B1
  15 0.305: v142.88,129.03 146.18,132.33 176.91,132.33 181.99,127.25 185.8,127.25 209.42,103.63 209.42,99.31 v209.68,99.06 | v274.7,67.82 274.7,69.85 269.62,74.93 269.62,75.18 v248.28,96.52
  Bottom 0.305: v209.68,99.06 210.44,98.3 233.81,98.3 235.08,97.03 v235.08,96.52 235.33,96.77 236.35,96.77 237.87,98.3 246.51,98.3 v248.28,96.52
I_ADD01  (via drill 0.61)
  Top 0.305: v57.02,43.43 57.28,43.69 v57.28,65.79 | v188.09,66.04 193.42,60.71 v193.42,52.32 | v260.22,125.22 260.22,120.9 261.49,119.63 A04.D1 | v236.35,98.3 231.52,98.3 231.52,90.68 v231.27,90.42
  2 0.305: v247.52,36.32 247.52,36.83 258.19,47.5 259.97,47.5 261.24,48.77 B04.D1 | v260.22,125.22 259.71,125.22 257.43,122.94 257.43,118.87 237.11,98.55 236.6,98.55 v236.35,98.3 | v231.27,90.42 193.42,52.58 v193.42,52.32
  15 0.305: v234.82,49.02 v247.52,36.32
  Bottom 0.305: v57.02,43.43 52.96,43.43 B20.F2 | v57.28,65.79 146.94,65.79 147.19,66.04 v188.09,66.04 | v193.42,52.32 195.2,50.55 200.28,50.55 200.53,50.29 203.84,50.29 204.09,50.55 212.98,50.55 215.26,48.26 216.53,48.26 217.04,47.75 231.01,47.75 232.79,49.53 234.31,49.53 v234.82,49.02
I_ADD02  (via drill 0.61)
  Top 0.305: v264.03,88.65 263.78,88.9 263.78,103.89 264.03,104.14 264.03,108.71 263.78,108.97 263.78,114.55 264.54,115.32 A04.E1
  2 0.305: v117.73,67.82 v93.09,43.18 | v216.28,67.06 216.28,69.34 225.17,78.23 225.17,78.74 231.01,84.58 231.01,84.84 256.16,109.98 257.18,109.98 261.24,114.05 263.27,114.05 264.54,115.32 A04.E1 | v284.86,68.07 265.81,49.02 265.81,47.75 265.56,47.5 265.56,46.74 B04.E1
  15 0.305: v284.86,68.07 284.86,68.83 282.57,71.12 281.05,71.12 267.08,85.09 267.08,85.6 v264.03,88.65
  Bottom 0.305: v93.09,43.18 84.96,35.05 53.98,35.05 52.96,36.07 B20.J2 | v117.73,67.82 169.29,67.82 170.05,67.06 v216.28,67.06
I_ADD03  (via drill 0.61)
  Top 0.305: v93.34,37.85 102.49,28.7 v104.01,28.7 | v264.8,100.58 266.57,102.36 | 266.57,102.36 266.57,107.95 265.56,108.97 A04.H1 | 266.57,102.36 266.57,77.22 265.81,76.45 265.81,61.98 266.57,61.21 266.57,41.4 265.56,40.39 B04.H1
  2 0.305: v167.77,92.46 v104.01,28.7 | v252.86,88.65 v264.8,100.58
  Bottom 0.305: v93.34,37.85 89.79,37.85 83.95,32 54.23,32 52.96,30.73 B20.L2 | v167.77,92.46 168.02,92.71 172.09,92.71 172.59,92.2 188.59,92.2 191.39,95 200.53,95 200.79,94.74 203.84,94.74 204.09,95 214.25,95 217.04,92.2 234.06,92.2 236.85,89.41 238.89,89.41 239.65,88.65 v252.86,88.65
I_ADD04  (via drill 0.61)
  Top 0.305: v54.23,62.74 54.23,25.65 52.96,24.38 B20.N2
  2 0.305: v256.92,103.63 259.21,105.92 261.24,105.92 A04.J1 | v251.08,102.11 251.08,97.54 232.03,78.49 232.03,74.42 230.76,73.15 228.47,73.15 223.65,68.33 v223.39,68.07
  15 0.305: v114.94,67.82 v111.89,64.77 | v223.39,68.07 226.44,68.07 229.24,65.28 230.25,65.28 245.24,50.29 246.25,50.29 258.19,38.35 259.71,38.35 261.24,36.83 B04.J1
  Bottom 0.305: v54.23,62.74 56.26,64.77 v111.89,64.77 | v114.94,67.82 115.95,68.83 171.32,68.83 172.34,67.82 215.52,67.82 215.77,68.07 v223.39,68.07 | v256.92,103.63 255.65,102.36 253.62,102.36 253.11,101.85 251.33,101.85 v251.08,102.11
I_ADD05  (via drill 0.61)
  Top 0.305: v164.21,93.98 165.23,95 165.23,99.57 | 165.23,99.57 165.23,114.3 181.74,130.81 230.25,130.81 230.25,127.51 232.54,125.22 235.08,125.22 235.08,127.25 238.89,131.06 238.89,131.57 239.4,132.08 254.13,132.08 254.13,122.43 260.48,116.08 260.48,109.73 263.27,106.93 263.27,104.39 262.51,103.63 262.51,100.58 A04.L1 | v252.35,1.27 252.35,3.56 260.22,11.43 260.22,24.13 262,25.91 262,29.46 B04.L1 | v176.4,61.21 177.67,62.48 177.67,87.12 165.23,99.57
  2 0.305: v164.21,93.98 v91.31,21.08
  15 0.305: v252.35,1.27 251.33,2.29 239.65,2.29 238.63,3.3 236.09,3.3 234.06,5.33 232.54,5.33 230.5,7.37 229.49,7.37 195.71,41.15 191.9,41.15 187.58,45.47 187.58,49.53 184.28,52.83 184.28,53.34 v176.4,61.21
  Bottom 0.305: v91.31,21.08 89.53,19.3 54.23,19.3 52.96,18.03 B20.R2
I_ADD06  (via drill 0.61)
  Top 0.305: 266.57,28.7 266.83,28.96 v266.83,39.37 | 266.57,28.7 265.56,27.69 B04.M1 | v285.88,58.67 285.62,58.93 285.62,59.18 283.85,60.96 282.83,60.96 v282.83,67.82 | v41.53,62.74 41.53,51.05 40.26,49.78 B21.D2 | v257.18,4.32 266.57,13.72 266.57,28.7
  2 0.305: v266.83,39.37 266.83,43.43 280.29,56.9 284.35,56.9 285.88,58.42 v285.88,58.67
  15 0.305: v282.83,67.82 281.05,69.6 281.05,70.1 263.02,88.14 263.02,89.66 v259.46,93.22 | v138.81,66.8 140.84,66.8 162.94,44.7 168.28,44.7 178.69,34.29 179.71,34.29 210.69,3.3 219.58,3.3 v220.09,3.81
  Bottom 0.305: v259.46,93.22 262.51,96.27 264.54,96.27 A04.M1 | v41.53,62.74 45.59,66.8 v138.81,66.8 | v220.09,3.81 220.6,3.3 256.16,3.3 v257.18,4.32
I_ADD07  (via drill 0.61)
  Top 0.305: v262.51,15.75 264.54,17.78 264.54,20.07 B04.P1 264.8,21.34 264.8,21.59 263.78,22.61 263.78,59.44 265.05,60.71 265.05,75.44 263.78,76.71 263.78,84.84 265.05,86.11 265.05,89.92 A04.P1
  2 0.305: v70.74,52.58 70.99,52.58 v81.41,62.99
  15 0.305: v175.64,64.52 175.64,63.5 177.42,61.72 177.42,61.21 185.04,53.59 185.04,53.09 217.04,21.08 218.31,21.08 220.09,19.3 224.41,19.3 v227.46,16.26
  Bottom 0.305: v70.74,52.58 70.74,51.05 64.39,44.7 41.53,44.7 40.26,43.43 B21.F2 | v81.41,62.99 82.17,63.75 145.41,63.75 146.69,65.02 147.19,65.02 147.45,65.28 174.88,65.28 v175.64,64.52 | v227.46,16.26 227.97,15.75 v262.51,15.75
I_ADD08  (via drill 0.61)
  2 0.305: v135.25,103.89 103,71.63 83.69,71.63 50.42,38.35 48.64,38.35 48.13,37.85 45.34,37.85 44.58,37.08 40.26,37.08 B21.J2
  15 0.305: v135.25,103.89 135.51,103.89 137.54,101.85 154.81,101.85 v181.74,74.93 | v203.33,71.63 237.87,37.08 237.87,36.83 239.14,35.56 239.4,35.56 260.22,14.73 264.54,14.73 B04.S1
  Bottom 0.305: v181.74,74.93 184.02,72.64 203.33,72.64 | 203.33,72.64 203.84,72.64 204.34,73.15 220.34,73.15 220.6,73.41 223.14,73.41 223.39,73.15 237.11,73.15 238.89,74.93 241.17,74.93 242.7,76.45 255.4,76.45 262.51,83.57 264.54,83.57 A04.S1 | 203.33,72.64 v203.33,71.63
I_ADD09  (via drill 0.61)
  Top 0.305: v252.35,36.07 254.13,37.85 254.13,44.7 255.14,45.72 255.14,48.51 B04.D2 | v235.33,116.08 232.28,119.13 232.28,120.65 229.24,123.7 206.12,123.7 206.12,116.08 199.77,109.73 199.77,97.03 196.72,93.98 196.72,81.28 193.93,78.49 193.93,65.79 194.44,65.28 v194.44,65.02 | v182.25,64.52 181.48,63.75 181.48,59.69 181.23,59.44 181.23,44.45 v180.97,44.2
  2 0.305: v228.22,19.05 240.16,19.05 247.52,26.42 247.52,31.24 v252.35,36.07 | v245.49,123.95 243.71,122.17 242.7,122.17 237.36,116.84 236.09,116.84 v235.33,116.08
  15 0.305: v180.97,44.2 181.48,44.2 191.39,34.29 192.41,34.29 194.69,32 199.26,32 v212.22,19.05 | v245.49,123.95 245.75,123.7 246.51,123.7 250.82,119.38 254.89,119.38 A04.D2
  Bottom 0.305: v180.97,44.2 178.69,44.2 175.9,41.4 159.89,41.4 159.13,42.16 158.12,42.16 157.35,41.4 108.08,41.4 105.28,44.2 89.79,44.2 83.44,37.85 51.69,37.85 48.9,35.05 40.26,35.05 40.26,30.73 B21.L2 | v212.22,19.05 v228.22,19.05 | v194.44,65.02 193.93,64.52 v182.25,64.52
I_ADD10  (via drill 0.61)
  Top 0.305: v244.22,131.06 251.08,131.06 251.08,121.67 256.41,116.33 258.19,116.33 A04.E2 | v202.56,64.26 199.77,67.06 199.77,89.41 v197.99,91.19
  2 0.305: v244.22,131.06 227.71,114.55 226.44,114.55 225.93,114.05 223.14,114.05 222.38,113.28 220.85,113.28 215.26,107.7 210.44,107.7 203.33,100.58 203.33,98.04 203.07,97.79 203.07,96.27 v197.99,91.19 182.75,75.95 178.69,75.95 137.03,34.29 136.02,34.29 111.12,9.4 105.79,9.4 103.25,6.86 102.23,6.86 101.47,6.1 70.74,6.1 66.17,1.52 44.32,23.37 40.26,23.37 B21.N2
  15 0.305: v245.24,62.74 253.62,54.36 253.62,53.09 258.44,48.26 258.44,46.74 B04.E2
  Bottom 0.305: v245.24,62.74 243.71,64.26 v202.56,64.26
I_ADD11  (via drill 0.61)
  Top 0.305: v47.62,40.13 47.62,36.07 44.58,33.02 44.58,18.03 40.26,18.03 B21.R2 | B04.H2 259.21,40.39 260.22,41.4 260.22,61.72 259.46,62.48 259.46,76.45 260.48,77.47 260.48,107.7 259.21,108.97 A04.H2
  2 0.305: v47.62,40.13 83.44,75.95 100.2,75.95 v155.32,131.06
  15 0.305: v232.03,131.32 232.54,131.32 232.79,131.06 233.55,131.06 242.44,122.17 243.21,122.17 v253.37,112.01
  Bottom 0.305: v155.32,131.06 155.57,131.32 v232.03,131.32 | v253.37,112.01 255.4,109.98 258.19,109.98 A04.H2
I_BAC00  (via drill 0.61)
  Top 0.305: v191.39,61.21 191.39,59.18 184.28,52.07 184.28,41.66 183.01,40.39 B10.H2
  2 0.305: v284.86,74.68 285.12,74.93 285.12,75.44 285.88,76.2 285.88,87.63 286.13,87.88 286.13,88.39 287.65,89.92 287.65,90.93 288.93,92.2 288.93,94.23 289.18,94.49 289.18,103.89 295.53,110.24 295.53,116.59 299.59,120.65 299.59,124.71 A01.B1